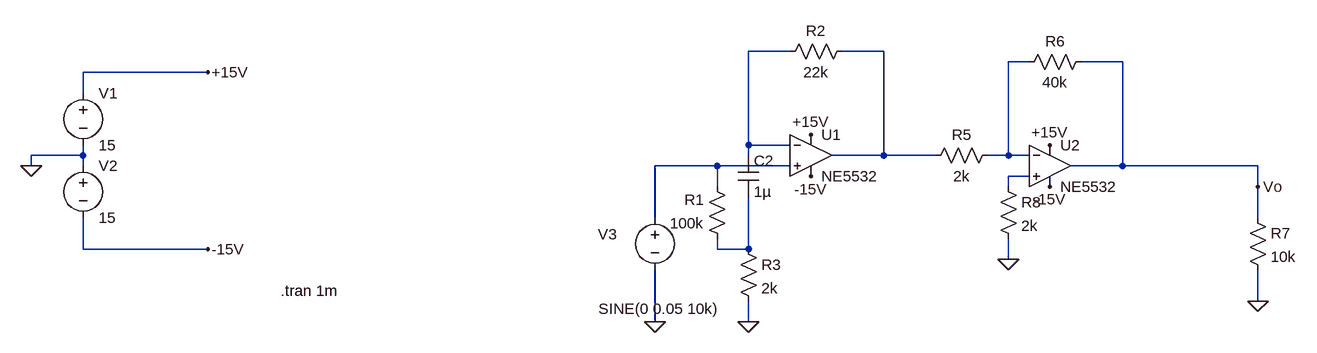
[diagram p0: schematic Class1高增益电压放大器.asc]
Class1高增益电压放大器.asc, the LTspice schematic file:
Version 4
SHEET 1 1668 680
WIRE 528 -16 464 -16
WIRE 672 -16 608 -16
WIRE 896 0 864 0
WIRE 1040 0 976 0
WIRE -368 16 -560 16
WIRE -560 48 -560 16
WIRE 464 128 464 -16
WIRE 528 128 464 128
WIRE -560 144 -560 128
WIRE -560 144 -640 144
WIRE 464 144 464 128
WIRE 672 144 672 -16
WIRE 672 144 592 144
WIRE 752 144 672 144
WIRE 864 144 864 0
WIRE 864 144 832 144
WIRE 896 144 864 144
WIRE -640 160 -640 144
WIRE -560 160 -560 144
WIRE 416 160 320 160
WIRE 528 160 416 160
WIRE 1040 160 1040 0
WIRE 1040 160 960 160
WIRE 1248 160 1040 160
WIRE 896 176 864 176
WIRE 416 192 416 160
WIRE 864 192 864 176
WIRE 1248 192 1248 160
WIRE 320 240 320 160
WIRE 1248 240 1248 192
WIRE -560 288 -560 240
WIRE -368 288 -560 288
WIRE 416 288 416 272
WIRE 464 288 464 208
WIRE 464 288 416 288
WIRE 864 304 864 272
WIRE 1248 368 1248 320
WIRE 320 400 320 320
WIRE 464 400 464 368
FLAG -640 160 0
FLAG -368 16 +15V
FLAG -368 288 -15V
FLAG 560 112 +15V
FLAG 560 176 -15V
FLAG 464 400 0
FLAG 320 400 0
FLAG 1248 368 0
FLAG 1248 192 Vo
FLAG 928 128 +15V
FLAG 928 192 -15V
FLAG 864 304 0
SYMBOL voltage -560 32 R0
SYMATTR InstName V1
SYMATTR Value 15
SYMBOL voltage -560 144 R0
SYMATTR InstName V2
SYMATTR Value 15
SYMBOL res 432 288 R180
WINDOW 0 36 76 Left 2
WINDOW 3 36 40 Left 2
SYMATTR InstName R1
SYMATTR Value 100k
SYMBOL res 624 -32 R90
WINDOW 0 0 56 VBottom 2
WINDOW 3 32 56 VTop 2
SYMATTR InstName R2
SYMATTR Value 22k
SYMBOL res 448 272 R0
SYMATTR InstName R3
SYMATTR Value 2k
SYMBOL voltage 320 224 R0
WINDOW 3 -87 156 Left 2
WINDOW 123 -87 128 Left 2
WINDOW 39 -128 77 Left 2
WINDOW 0 -88 41 Left 2
SYMATTR Value SINE(0 0.05 10k)
SYMATTR InstName V3
SYMBOL res 1232 224 R0
SYMATTR InstName R7
SYMATTR Value 10k
SYMBOL EXTRA\\AudioOpamp\\TI\\NE5532 560 144 R0
SYMATTR InstName U1
SYMBOL res 848 128 R90
WINDOW 0 0 56 VBottom 2
WINDOW 3 32 56 VTop 2
SYMATTR InstName R5
SYMATTR Value 2k
SYMBOL res 992 -16 R90
WINDOW 0 0 56 VBottom 2
WINDOW 3 32 56 VTop 2
SYMATTR InstName R6
SYMATTR Value 40k
SYMBOL res 848 176 R0
SYMATTR InstName R8
SYMATTR Value 2k
SYMBOL EXTRA\\AudioOpamp\\TI\\NE5532 928 160 R0
SYMATTR InstName U2
SYMBOL cap 448 144 R0
SYMATTR InstName C2
SYMATTR Value 1µ
TEXT -256 352 Left 2 !.tran 1m

The netlist it stands for:
* Class1高增益电压放大器.asc
V1 +15V 0 15
V2 0 -15V 15
R1 N006 N004 100k
R2 N002 N001 22k
R3 N006 0 2k
V3 N004 0 SINE(0 0.05 10k)
R7 Vo 0 10k
XU1 N004 N001 +15V -15V N002 NE5532  ; pins In+ In- V+ V- OUT
R5 N003 N002 2k
R6 Vo N003 40k
R8 N005 0 2k
XU2 N005 N003 +15V -15V Vo NE5532  ; pins In+ In- V+ V- OUT
C2 N001 N006 1µ
.tran 1m
.backanno
.end